# EAGLE design darkgame-controller (EAGLE 6.2)
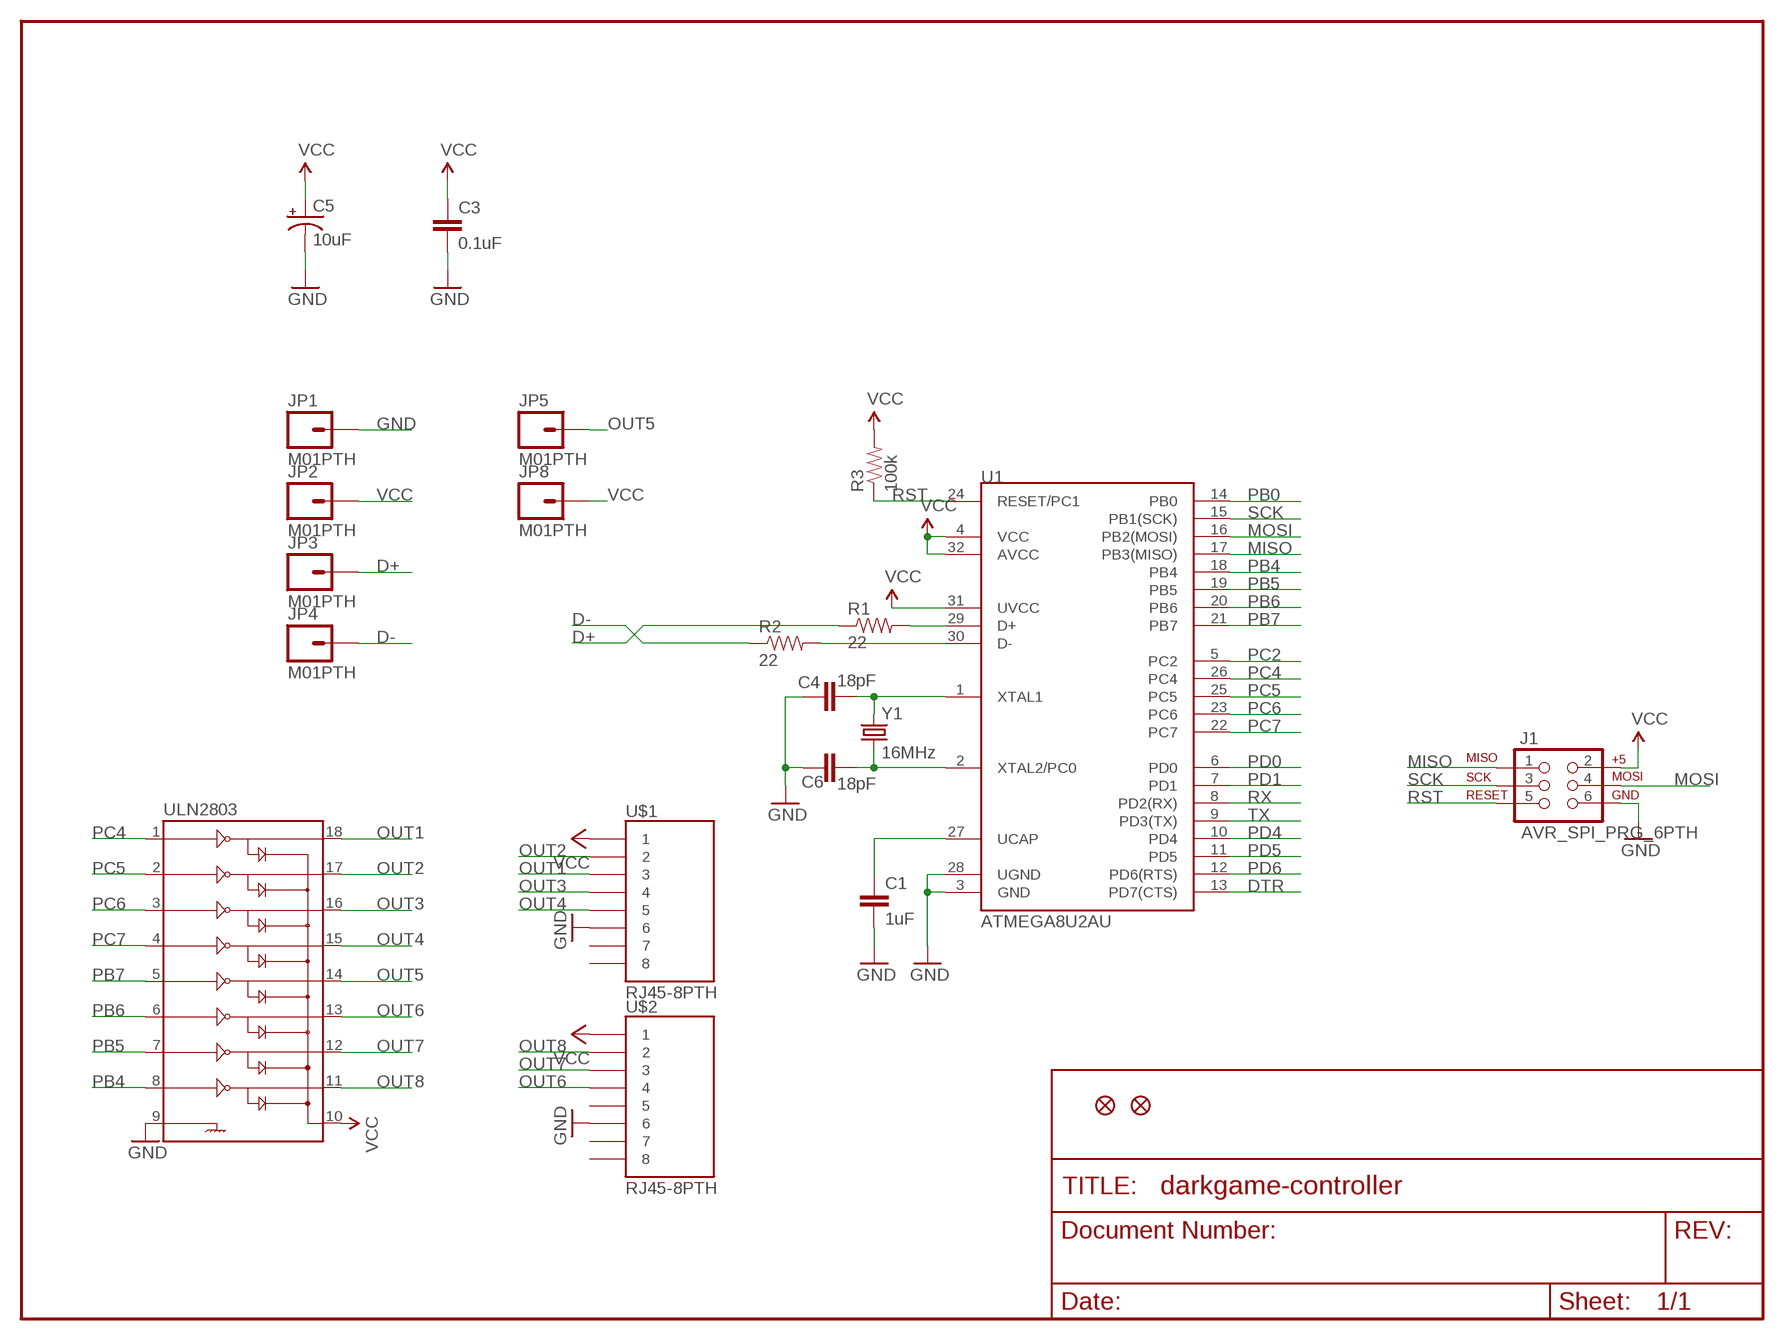
[diagram p0: schematic, sheet 1]

## Parts
C1  1uF  CAP0805  [0805]
C3  0.1uF  CAP0805  [0805]
C4  18pF  CAP0805  [0805]
C5  10uF  CAP_POL1206  [EIA3216]
C6  18pF  CAP0805  [0805]
J1  AVR_SPI_PRG_6PTH  [2X3]
JP1  M01PTH  [1X01]
JP2  M01PTH  [1X01]
JP3  M01PTH  [1X01]
JP4  M01PTH  [1X01]
JP5  M01PTH  [1X01]
JP6  FIDUCIAL1X2  [FIDUCIAL-1X2]
JP7  FIDUCIAL1X2  [FIDUCIAL-1X2]
JP8  M01PTH  [1X01]
R1  22  RESISTOR0805-RES  [0805]
R2  22  RESISTOR0805-RES  [0805]
R3  100k  RESISTOR0805-RES  [0805]
U1  ATMEGA8U2AU  [TQFP32-08]
U$1  RJ45-8PTH  [RJ45-8]
U$2  RJ45-8PTH  [RJ45-8]
ULN2803  ULN2803SOICW  [SO18L]
Y1  16MHz  CRYSTAL5X3  [CRYSTAL-SMD-5X3]

## Nets
D+: JP3.1 R1.1
D-: JP4.1 R2.1
DTR: U1.13(PD7(CTS))
GND: C1.2 C3.2 C4.2 C5.C(-) C6.2 J1.6 JP1.1 U1.3(GND) U1.28(UGND) U$1.6 U$2.6 ULN2803.9
MISO: J1.1 U1.17(PB3(MISO))
MOSI: J1.4 U1.16(PB2(MOSI))
N$3: R1.2 U1.29(D+)
N$4: R2.2 U1.30(D-)
N$8: C4.1 U1.1(XTAL1) Y1.3
N$9: C6.1 U1.2(XTAL2/PC0) Y1.1
N$12: C1.1 U1.27(UCAP)
OUT1: U$1.3 ULN2803.18
OUT2: U$1.2 ULN2803.17
OUT3: U$1.4 ULN2803.16
OUT4: U$1.5 ULN2803.15
OUT5: JP5.1 ULN2803.14
OUT6: U$2.4 ULN2803.13
OUT7: U$2.3 ULN2803.12
OUT8: U$2.2 ULN2803.11
PB0: U1.14(PB0)
PB4: U1.18(PB4) ULN2803.8
PB5: U1.19(PB5) ULN2803.7
PB6: U1.20(PB6) ULN2803.6
PB7: U1.21(PB7) ULN2803.5
PC2: U1.5(PC2)
PC4: U1.26(PC4) ULN2803.1
PC5: U1.25(PC5) ULN2803.2
PC6: U1.23(PC6) ULN2803.3
PC7: U1.22(PC7) ULN2803.4
PD0: U1.6(PD0)
PD1: U1.7(PD1)
PD4: U1.10(PD4)
PD5: U1.11(PD5)
PD6: U1.12(PD6(RTS))
RST: J1.5 R3.1 U1.24(RESET/PC1)
RX: U1.8(PD2(RX))
SCK: J1.3 U1.15(PB1(SCK))
TX: U1.9(PD3(TX))
VCC: C3.1 C5.A(+) J1.2 JP2.1 JP8.1 R3.2 U1.4(VCC) U1.31(UVCC) U1.32(AVCC) U$1.1 U$2.1 ULN2803.10
Unconnected: U$1.7 U$1.8 U$2.5 U$2.7 U$2.8

## Library data of the parts
C1 C3 C4 C6 = SparkFun:CAP: Capacitor Standard 0603 ceramic capacitor, and 0.1" leaded capacitor.
C5 = SparkFun:CAP_POL: Capacitor Polarized These are standard SMD and PTH capacitors. Normally 10uF, 47uF, and 100uF in electrolytic and tantalum varieties. Always verify the external diameter of the through hole cap, it varies with capacity, voltage, and manufacturer. The EIA devices should be standard.
J1 = SparkFun:AVR_SPI_PRG_6: AVR ISP 6 Pin This is the reduced ISP connector for AVR programming. Common on Arduino. This footprint will take up less PCB space and can be used with a 10-pin to 6-pin adapter such as SKU: BOB-08508
JP1-JP5 JP8 = SparkFun-Connectors:M01: Header 1 Standard 1-pin 0.1" header. Use with straight break away headers (SKU : PRT-00116), right angle break away headers (PRT-00553), swiss pins (PRT-00743), machine pins (PRT-00117), and female headers (PRT-00115).
JP6 JP7 = SparkFun:FIDUCIAL: Fiducial Alignment Points Various fiducial points for machine vision alignment.
R1-R3 = SparkFun:RESISTOR: Resistor Basic schematic elements and footprints for 0603, 1206, and PTH resistors.
U1 = SparkFun:ATMEGA8U2: Atmel 8-bit Microcontroller with 8/16/32K Bystes of ISP Flash and USB Controller. ATmega8U2, ATmega16U2, and ATmega32U2
U$1 U$2 = SparkFun-Connectors:RJ45-8: RJ45 Jack Simple RJ45, 8-pin connection - connector for common Cat5, Cat5e, and Cat6 Ethernet cables. Footprint not yet proven in production. Connector sku is PRT-00643; Breakout PCB sku is BOB-00716.
ULN2803 = SparkFun-PowerIC:ULN2803: Darlington Driver ULN2803 Darlington array. 500mA max per channel, 8-channel package. Spark Fun Electronics SKU : COM-00312
Y1 = SparkFun:CRYSTAL: Crystals Various standard crystals. Proven footprints. Spark Fun Electronics SKU : COM-00534

## Board
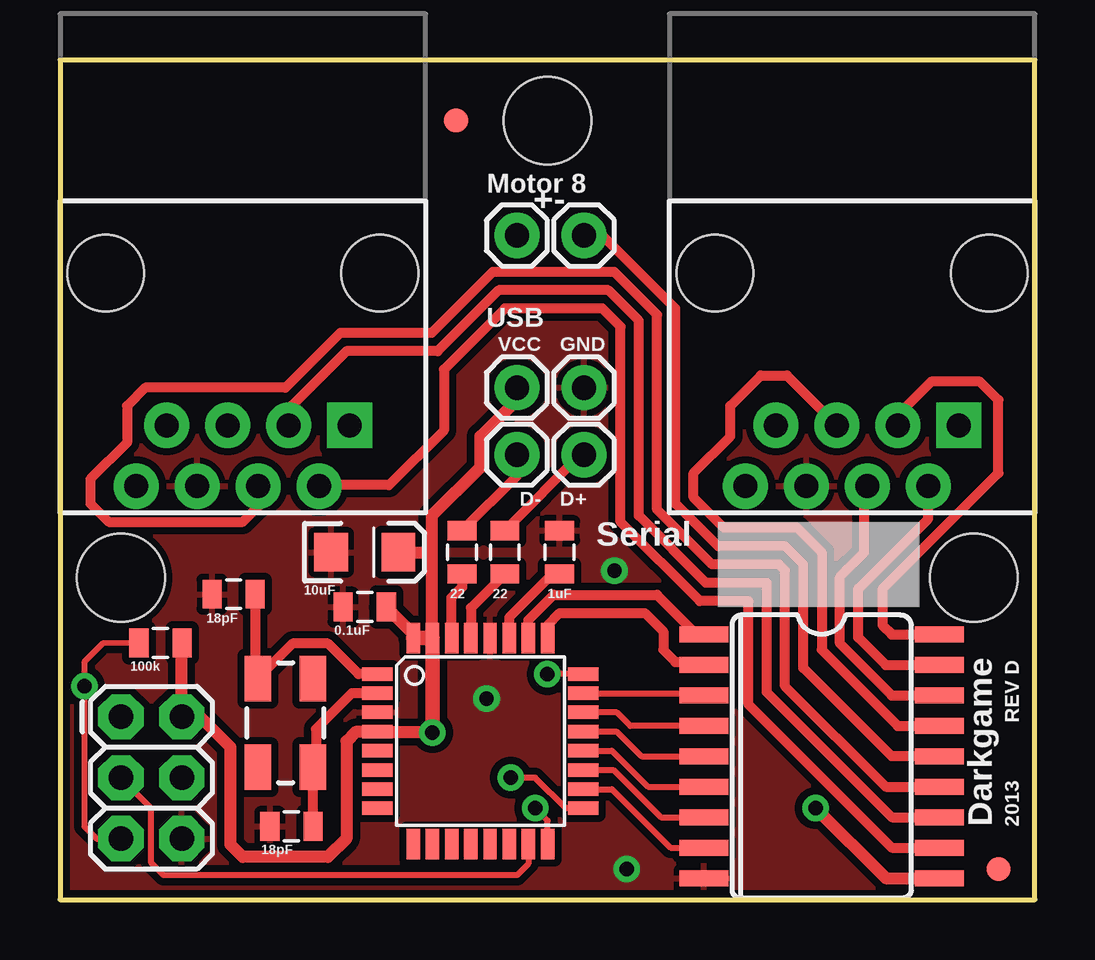
[diagram p1: board, top side]
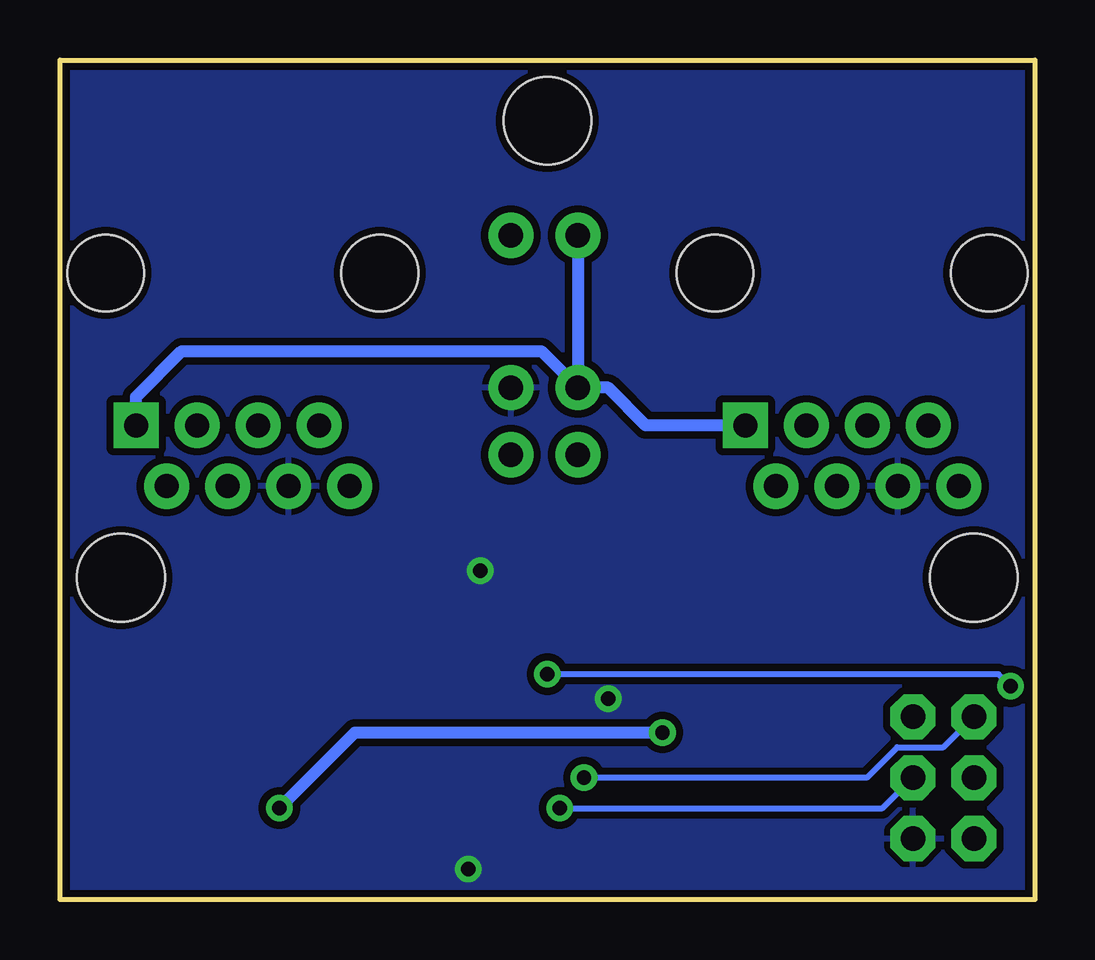
[diagram p2: board, bottom side, seen from below]

Size 40.64 x 35 mm. Coordinates in mm from the lower left corner, seen from the top.
Outline: 0,0 40.64,0 40.64,35 0,35 0,0
Copper layers (1*16): Top 0.035mm / dielectric 1.5mm / Bottom 0.035mm
Design rules: minimum track width 8mil, minimum drill 20mil, track to track 8mil, track to pad 8mil, pad to pad 8mil, via to via 8mil, smd to smd 8mil, copper to edge 8mil, drill to drill 8mil, minimum pad ring 12mil, minimum via ring 10mil, stop-mask expansion 4mil, vias tented up to drill 100mil, thermal gap 10mil
Holes 3.66 mm at 20.32,32.47 2.54,13.42 38.1,13.42

### Footprints (pad centres in the part's own frame; a part is rotated, then mirrored left to right if it is on the bottom)
0805 = smd 0.8 x 1.2: 1 -0.9,0; 2 0.9,0
EIA3216 = smd 1.4 x 1.6: A 1.4,0; C -1.4,0
2X3 = drill 1.016 pad 1.88 octagon: 1 0,0; 2 0,2.54; 3 2.54,0; 4 2.54,2.54; 5 5.08,0; 6 5.08,2.54
1X01 = drill 1.016 pad 1.88: 1 0,0
FIDUCIAL-1X2 = smd 1 x 1: 1 0,0
TQFP32-08 = smd 1.27 x 0.559: 1 -4.293,2.8; 2 -4.293,2; 3 -4.293,1.2; 4 -4.293,0.4; 5 -4.293,-0.4; 6 -4.293,-1.2; 7 -4.293,-2; 8 -4.293,-2.8; 17 4.293,-2.8; 18 4.293,-2; 19 4.293,-1.2; 20 4.293,-0.4; 21 4.293,0.4; 22 4.293,1.2; 23 4.293,2; 24 4.293,2.8 | smd 0.559 x 1.27: 9 -2.8,-4.293; 10 -2,-4.293; 11 -1.2,-4.293; 12 -0.4,-4.293; 13 0.4,-4.293; 14 1.2,-4.293; 15 2,-4.293; 16 2.8,-4.293; 25 2.8,4.293; 26 2,4.293; 27 1.2,4.293; 28 0.4,4.293; 29 -0.4,4.293; 30 -1.2,4.293; 31 -2,4.293; 32 -2.8,4.293
RJ45-8 = drill 1 pad 1.88 square: 1 -4.445,6.35 | drill 1 pad 1.88: 2 -3.175,8.89; 3 -1.905,6.35; 4 -0.635,8.89; 5 0.635,6.35; 6 1.905,8.89; 7 3.175,6.35; 8 4.445,8.89 | hole 3.2: -5.715,0; 5.715,0
SO18L = smd 0.66 x 2.032: 1 -0.635,-4.902; 2 0.635,-4.902; 3 1.905,-4.902; 4 3.175,-4.902; 5 4.445,-4.902; 6 5.715,-4.902; 7 6.985,-4.902; 8 8.255,-4.902; 9 9.525,-4.902; 10 9.525,4.902; 11 8.255,4.902; 12 6.985,4.902; 13 5.715,4.902; 14 4.445,4.902; 15 3.175,4.902; 16 1.905,4.902; 17 0.635,4.902; 18 -0.635,4.902
CRYSTAL-SMD-5X3 = smd 1.9 x 1.1: 1 -1.85,-1.15; 2 1.85,-1.15; 3 1.85,1.15; 4 -1.85,1.15

### Placement (x,y rotation side)
C1  20.83,14.48 90 top
C3  12.7,12.19 180 top
C4  7.24,12.73 180 top
C5  12.7,14.48 0 top
C6  9.65,3.05 180 top
J1  2.54,7.62 270 top
JP1  21.84,21.34 0 top
JP2  19.05,21.34 0 top
JP3  21.84,18.54 0 top
JP4  19.05,18.54 0 top
JP5  21.84,27.69 0 top
JP6  16.51,32.47 0 top
JP7  39.12,1.27 0 top
JP8  19.05,27.69 0 top
R1  18.54,14.48 270 top
R2  16.76,14.48 270 top
R3  4.19,10.69 0 top
U1  17.53,6.6 0 top
U$1  33.02,26.12 180 top
U$2  7.62,26.12 180 top
ULN2803  31.75,10.41 270 top
Y1  9.4,7.37 90 top

### Tracks (layer width: path | path; a pad name or v marks a point on that pad's centre or on a via)
D+
  Top 0.406: JP3.1 21.71,18.54 R1.1
D-
  Top 0.406: JP4.1 19.05,17.66 R2.1
GND  (via drill 0.6)
  other vias: 23.11,13.72 17.78,8.38 23.62,1.27
  pour Top (isolate 0.305): 0,35 0,0 40.64,0 40.64,35
  pour Bottom (isolate 0.305): 0,35 0,0 40.64,0 40.64,35
MISO  (via drill 0.6)
  Top 0.254: U1.17 21.09,3.8 19.81,5.08 v18.8,5.08
  Bottom 0.254: J1.1 3.81,6.35 5.74,6.35 7.01,5.08 v18.8,5.08
MOSI  (via drill 0.6)
  Top 0.254: U1.16 20.33,3.3 v19.81,3.81
  Bottom 0.254: v19.81,3.81 6.35,3.81 J1.4
N$3
  Top 0.406: R1.2 17.13,12.16 U1.29
N$4
  Top 0.406: R2.2 16.76,13.03 16.31,12.57 16.31,10.92 U1.30
N$8
  Top 0.406: U1.1 12.44,9.4 11.18,10.67 9.7,10.67 Y1.3 | 8.27,9.24 Y1.3 | C4.1 8.14,9.32 Y1.3
N$9
  Top 0.406: Y1.1 | C6.1 10.56,5.51 Y1.1 | U1.2 12.16,8.6 10.67,7.11 10.67,5.64 Y1.1
N$12
  Top 0.406: C1.1 20.54,13.58 18.72,11.76 U1.27
OUT1
  Top 0.406: U$1.3 35.05,19.9 35.05,20.32 36.32,21.59 38.35,21.59 39.12,20.83 39.12,17.78 34.29,12.95 34.29,11.43 34.67,11.05 ULN2803.18 36.52,11.18
OUT2
  Top 0.406: U$1.2 36.2,15.88 33.27,12.95 33.27,10.92 34.42,9.78 ULN2803.17
OUT3
  Top 0.406: U$1.4 33.53,17.1 33.53,14.48 32.51,13.46 32.51,10.67 34.67,8.51 ULN2803.16
OUT4
  Top 0.406: U$1.5 30.31,21.84 29.21,21.84 27.94,20.57 27.94,19.3 26.42,17.78 26.42,16.76 27.69,15.49 30.73,15.49 31.75,14.48 31.75,10.41 34.92,7.24 ULN2803.15
OUT5
  Top 0.406: ULN2803.14 34.67,5.97 30.99,9.65 30.99,13.97 30.23,14.73 27.43,14.73 25.65,16.51 25.65,24.64 22.61,27.69 JP5.1
OUT6
  Top 0.406: U$2.4 8.38,17.1 8.38,16.51 7.62,15.75 2.03,15.75 1.27,16.51 1.27,17.53 2.79,19.05 2.79,20.57 3.56,21.34 9.4,21.34 11.68,23.62 15.49,23.62 18.03,26.16 23.11,26.16 24.89,24.38 24.89,16.26 27.18,13.97 29.97,13.97 30.23,13.72 30.23,8.89 34.42,4.7 ULN2803.13
OUT7
  Top 0.406: U$2.3 9.65,19.9 9.65,20.57 11.94,22.86 15.75,22.86 18.29,25.4 22.86,25.4 24.13,24.13 24.13,16 26.92,13.21 29.46,13.21 29.46,8.64 34.67,3.43 ULN2803.12
OUT8
  Top 0.406: U$2.2 10.84,17.27 13.72,17.27 16,19.56 16,22.1 18.54,24.64 22.61,24.64 23.37,23.88 23.37,15.75 26.67,12.45 28.7,12.45 28.7,8.13 34.67,2.16 ULN2803.11
PB4
  Top 0.254: U1.18 23.01,4.6 25.45,2.16 ULN2803.8
PB5
  Top 0.254: U1.19 23.07,5.4 25.04,3.43 ULN2803.7
PB6
  Top 0.254: U1.20 23.01,6.2 24.51,4.7 ULN2803.6
PB7
  Top 0.254: U1.21 23.2,7 24.23,5.97 ULN2803.5
PC4
  Top 0.406: U1.26 19.53,11.65 20.57,12.7 24.89,12.7 26.42,11.18 26.72,11.18 ULN2803.1
PC5
  Top 0.406: U1.25 20.33,11.44 20.83,11.94 24.38,11.94 25.15,11.18 25.15,10.41 25.65,9.91 26.72,9.91 ULN2803.2
PC6
  Top 0.254: U1.23 26.75,8.6 ULN2803.3
PC7
  Top 0.254: ULN2803.4 23.77,7.24 23.22,7.8 U1.22
RST  (via drill 0.6)
  Top 0.254: U1.24 v20.32,9.4 | J1.5 1.52,2.54 1.02,3.05 v1.02,8.89 1.02,9.91 1.78,10.67 R3.1
  Bottom 0.254: v20.32,9.4 1.52,9.4 v1.02,8.89
SCK
  Top 0.254: U1.15 19.53,1.49 19.05,1.02 4.32,1.02 3.81,1.52 3.81,3.81 J1.3
VCC  (via drill 0.6)
  Top 0.508: JP2.1 19.05,20.83 17.53,19.3 17.53,18.03 15.49,16 15.49,14.48 | 15.49,14.48 15.49,10.93 U1.31 | C5.A 15.49,14.48 | 13.43,12.19 C3.1 14.73,11.07 U1.32 | 13.25,6.99 12.32,6.99 11.94,6.6 11.94,2.54 11.18,1.78 7.62,1.78 7.11,2.29 7.11,6.35 5.84,7.62 J1.2 5.08,10.55 R3.2 | 13.25,6.99 U1.4 | 13.25,6.99 15.51,6.99 v15.53,6.97 | v31.5,3.81 34.42,0.89 ULN2803.10
  Top 0.61: v15.53,6.97 U1.31 U1.32
  Bottom 0.508: v31.5,3.81 28.34,6.97 v15.53,6.97 | U$2.1 16.21,19.77 17.78,21.34 JP2.1 | U$1.1 37.47,20.95 35.56,22.86 20.57,22.86 JP2.1 | JP8.1 JP2.1

### Text on the board
tPlace: Motor 8 | + | - | USB | VCC | GND | D- | D+ | Serial | 10uF | 22 | 22 | 1uF | 18pF | 0.1uF | REV D | Darkgame | 2013 | 18pF